# Altium schematic sheet 07_Clocks2.SchDoc: Clocks 2
size A3; Organization: Lime Microsystems; Address1: Surrey Tech Centre; Address2: Guildford GU2 7YG; Address3: Surrey; Address4: United Kingdom; Revision: v1.0; SheetNumber: 7; SheetTotal: 10
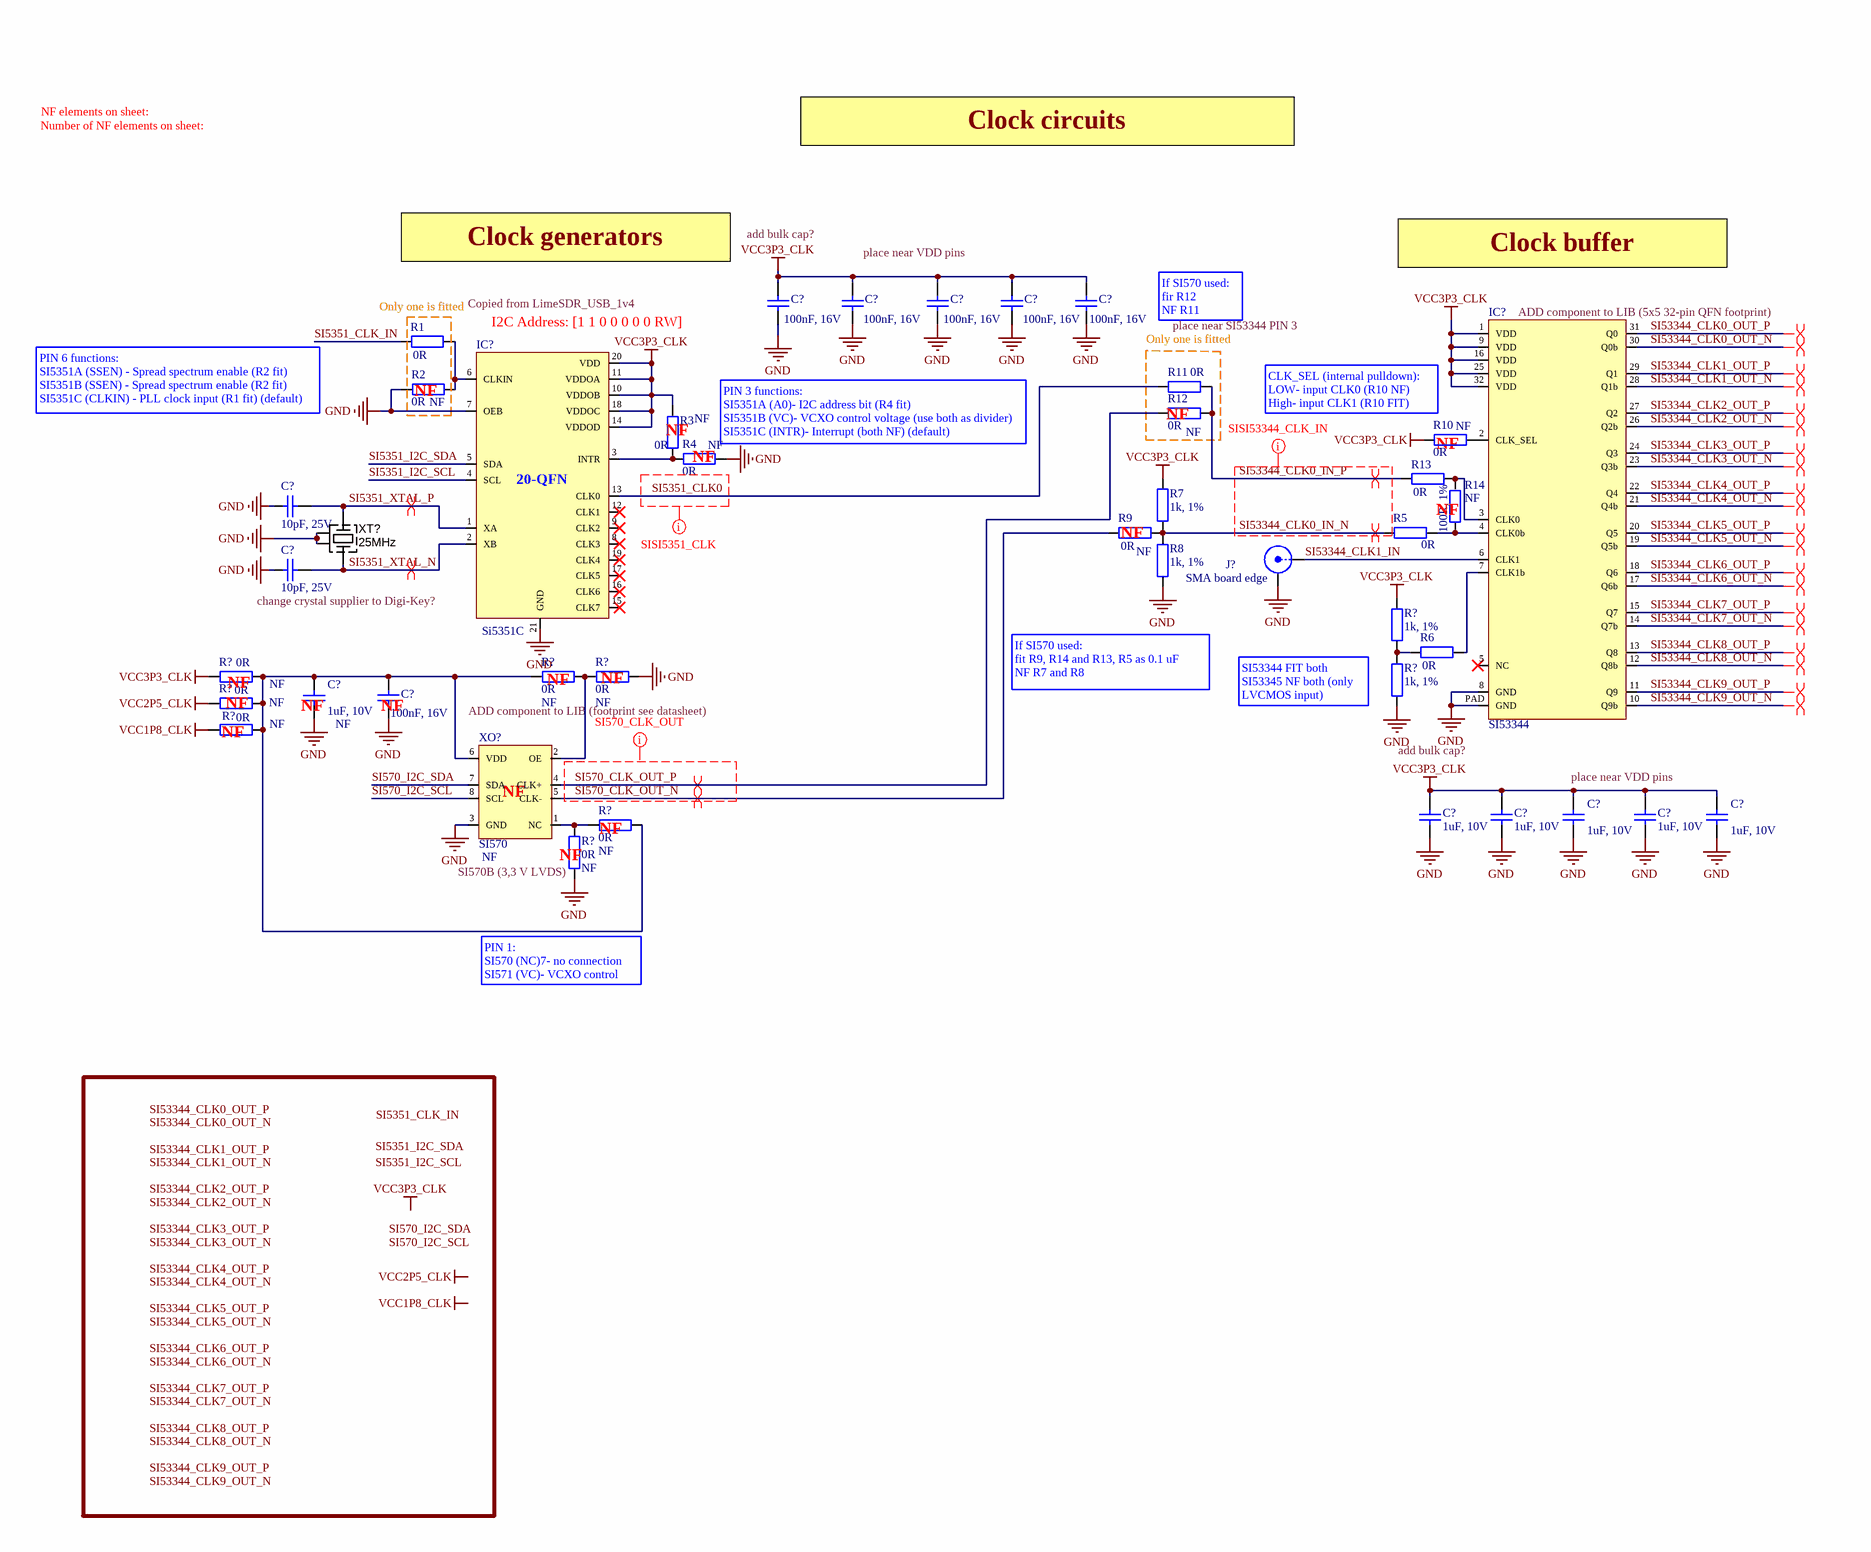
[diagram p0: 07_Clocks2.SchDoc, bottom]

## Parts
(Parts that share a designator on the sheet are numbered #1, #2 ... from top to bottom, then left to right.)
C?#1  100nF, 16V  [CAP0402]
C?#2  100nF, 16V  [CAP0402]
C?#3  100nF, 16V  [CAP0402]
C?#4  100nF, 16V  [CAP0402]
C?#5  100nF, 16V  [CAP0402]
C?#6  10pF, 25V  [CAP0402]
C?#7  10pF, 25V  [CAP0402]
C?#8  1uF, 10V  Assembly Info: NF  [CAP0402]
C?#9  100nF, 16V  [CAP0402]
C?#10  1uF, 10V  [CAP0402]
C?#11  1uF, 10V  [CAP0402]
C?#12  1uF, 10V  [CAP0402]
C?#13  1uF, 10V  [CAP0402]
C?#14  1uF, 10V  [CAP0402]
IC?#1  SI53344
IC?#2  Si5351C  [Si5351C_20QFN]
J?  SMA board edge  [SMA_connector_board_edge_SM]
R1  0R  [RES0402]
R2  0R  Assembly Info: NF  [RES0402]
R3  0R  Assembly Info: NF  [RES0402]
R4  0R  Assembly Info: NF  [RES0402]
R5  0R  [RES0402]
R6  0R  [RES0402]
R7  1k, 1%  [RES0402]
R8  1k, 1%  [RES0402]
R9  0R  Assembly Info: NF  [RES0402]
R10  0R  Assembly Info: NF  [RES0402]
R11  0R  [RES0402]
R12  0R  Assembly Info: NF  [RES0402]
R13  0R  [RES0402]
R14  100R, 1%  Assembly Info: NF  [RES0402]
R?#1  1k, 1%  [RES0402]
R?#2  0R  Assembly Info: NF  [RES0402]
R?#3  0R  Assembly Info: NF  [RES0402]
R?#4  0R  Assembly Info: NF  [RES0402]
R?#5  1k, 1%  [RES0402]
R?#6  0R  Assembly Info: NF  [RES0402]
R?#7  0R  Assembly Info: NF  [RES0402]
R?#8  0R  Assembly Info: NF  [RES0402]
R?#9  0R  Assembly Info: NF  [RES0402]
XO?  SI570  Assembly Info: NF
XT?  25MHz  [CRYSTAL_4-LCC]

## Nets
GND: C?#1.2 C?#2.2 C?#3.2 C?#4.2 C?#5.2 C?#6.1 C?#7.1 C?#8.1 C?#9.2 C?#10.2 C?#11.2 C?#12.1 C?#13.2 C?#14.1 IC?#1.8(GND) IC?#1.PAD(GND) IC?#2.7(OEB) IC?#2.21(GND) J?.2(Y) R2.2 R4.2 R8.1 R?#4.1 R?#5.1 R?#9.1 XO?.3(GND) XT?.2(GND) XT?.4(GND)
VCC1P8_CLK: R?#7.2
VCC2P5_CLK: R?#6.2
VCC3P3_CLK: C?#1.1 C?#2.1 C?#3.1 C?#4.1 C?#5.1 C?#10.1 C?#11.1 C?#12.2 C?#13.1 C?#14.2 IC?#1.1(VDD) IC?#1.9(VDD) IC?#1.16(VDD) IC?#1.25(VDD) IC?#1.32(VDD) IC?#2.10(VDDOB) IC?#2.11(VDDOA) IC?#2.14(VDDOD) IC?#2.18(VDDOC) IC?#2.20(VDD) R3.2 R7.1 R10.1 R?#1.1 R?#2.2
SI570_CLK_OUT_N: R9.1 XO?.5(CLK-)
SI570_CLK_OUT_P: R12.1 XO?.4(CLK+)
SI570_I2C_SCL: XO?.8(SCL)
SI570_I2C_SDA: XO?.7(SDA)
SI5351_CLK0: IC?#2.13(CLK0) R11.1
SI5351_CLK_IN: R1.1
SI5351_I2C_SCL: IC?#2.4(SCL)
SI5351_I2C_SDA: IC?#2.5(SDA)
SI5351_XTAL_N: C?#7.2 IC?#2.2(XB) XT?.3(X)
SI5351_XTAL_P: C?#6.2 IC?#2.1(XA) XT?.1(X)
SI53344_CLK0_IN_N: R5.1 R7.2 R8.2 R9.2
SI53344_CLK0_IN_P: R11.2 R12.2 R13.1
SI53344_CLK0_OUT_N: IC?#1.30(Q0b)
SI53344_CLK0_OUT_P: IC?#1.31(Q0)
SI53344_CLK1_IN: IC?#1.6(CLK1) J?.1(X)
SI53344_CLK1_OUT_N: IC?#1.28(Q1b)
SI53344_CLK1_OUT_P: IC?#1.29(Q1)
SI53344_CLK2_OUT_N: IC?#1.26(Q2b)
SI53344_CLK2_OUT_P: IC?#1.27(Q2)
SI53344_CLK3_OUT_N: IC?#1.23(Q3b)
SI53344_CLK3_OUT_P: IC?#1.24(Q3)
SI53344_CLK4_OUT_N: IC?#1.21(Q4b)
SI53344_CLK4_OUT_P: IC?#1.22(Q4)
SI53344_CLK5_OUT_N: IC?#1.19(Q5b)
SI53344_CLK5_OUT_P: IC?#1.20(Q5)
SI53344_CLK6_OUT_N: IC?#1.17(Q6b)
SI53344_CLK6_OUT_P: IC?#1.18(Q6)
SI53344_CLK7_OUT_N: IC?#1.14(Q7b)
SI53344_CLK7_OUT_P: IC?#1.15(Q7)
SI53344_CLK8_OUT_N: IC?#1.12(Q8b)
SI53344_CLK8_OUT_P: IC?#1.13(Q8)
SI53344_CLK9_OUT_N: IC?#1.10(Q9b)
SI53344_CLK9_OUT_P: IC?#1.11(Q9)
NetC?#8_2: C?#8.2 C?#9.1 R?#2.1 R?#3.2 R?#6.1 R?#7.1 R?#8.1 XO?.6(VDD)
NetIC?#1_2: IC?#1.2(CLK_SEL) R10.2
NetIC?#1_3: IC?#1.3(CLK0) R13.2 R14.2
NetIC?#1_4: IC?#1.4(CLK0b) R5.2 R14.1
NetIC?#1_7: IC?#1.7(CLK1b) R6.2
NetIC?#2_3: IC?#2.3(INTR) R3.1 R4.1
NetIC?#2_6: IC?#2.6(CLKIN) R1.2 R2.1
NetR6_1: R6.1 R?#1.2 R?#5.2
NetR?#3_1: R?#3.1 R?#4.2 XO?.2(OE)
NetR?#8_2: R?#8.2 R?#9.2 XO?.1(NC)

Not connected (* = marked no-connect by the designer): IC?#1 5(NC)*; IC?#2 8(CLK3)* 9(CLK2)* 12(CLK1)* 15(CLK7)* 16(CLK6)* 17(CLK5)* 19(CLK4)*

## Layout directives
differential pair: SI570_CLK_OUT_N, SI570_CLK_OUT_P, SI5351_XTAL_N, SI5351_XTAL_P, SI53344_CLK0_IN_N, SI53344_CLK0_IN_P, SI53344_CLK0_OUT_N, SI53344_CLK0_OUT_P, SI53344_CLK1_OUT_N, SI53344_CLK1_OUT_P, SI53344_CLK2_OUT_N, SI53344_CLK2_OUT_P, SI53344_CLK3_OUT_N, SI53344_CLK3_OUT_P, SI53344_CLK4_OUT_N, SI53344_CLK4_OUT_P, SI53344_CLK5_OUT_N, SI53344_CLK5_OUT_P, SI53344_CLK6_OUT_N, SI53344_CLK6_OUT_P, SI53344_CLK7_OUT_N, SI53344_CLK7_OUT_P, SI53344_CLK8_OUT_N, SI53344_CLK8_OUT_P, SI53344_CLK9_OUT_N, SI53344_CLK9_OUT_P
net class SI_CLK: (no net found under the mark), SI5351_CLK0, SI53344_CLK0_IN_N, SI53344_CLK0_IN_P

## Notes on the sheet
- Number of NF elements on sheet:
- NF elements on sheet:
- Clock circuits
- Clock generators
- (near C?#1) add bulk cap?
- (near C?#3) place near VDD pins
- Clock buffer
- (near R1) Only one is fitted
- Copied from LimeSDR_USB_1v4
- I2C Address: [1 1 0 0 0 0 0 RW]
- Only one is fitted
- If SI570 used:
  fir R12
  NF R11
- place near SI53344 PIN 3
- (near IC?#1) ADD component to LIB (5x5 32-pin QFN footprint)
- PIN 6 functions:
  SI5351A (SSEN) - Spread spectrum enable (R2 fit)
  SI5351B (SSEN) - Spread spectrum enable (R2 fit)
  SI5351C (CLKIN) - PLL clock input (R1 fit) (default)
- (near R2) NF
- (near R3) NF
- (near R12) NF
- (near R10) CLK_SEL (internal pulldown):
  LOW- input CLK0 (R10 NF)
  High- input CLK1 (R10 FIT)
- (near R4) NF
- (near R4) PIN 3 functions:
  SI5351A (A0)- I2C address bit (R4 fit)
  SI5351B (VC)- VCXO control voltage (use both as divider)
  SI5351C (INTR)- Interrupt (both NF) (default)
- (near R10) NF
- (near R9) NF
- (near R14) NF
- (near IC?#2) change crystal supplier to Digi-Key?
- (near R?#2) NF
- (near R?#3) NF
- (near R?#4) NF
- If SI570 used:
  fit R9, R14 and R13, R5 as 0.1 uF
  NF R7 and R8
- (near R?#5) SI53344 FIT both
  SI53345 NF both (only LVCMOS input)
- (near R?#7) NF
- (near R?#6) NF
- (near C?#8) NF
- (near C?#9) NF
- (near R?#4) ADD component to LIB (footprint see datasheet)
- add bulk cap?
- (near XO?) NF
- (near R?#8) NF
- (near C?#13) place near VDD pins
- (near R?#9) SI570B (3,3 V LVDS)
- (near R?#9) NF
- PIN 1:
  SI570 (NC)7- no connection
  SI571 (VC)- VCXO control
- Labels drawn without touching a wire or pin: SI570_I2C_SCL, SI570_I2C_SDA, SI5351_CLK_IN, SI5351_I2C_SCL, SI5351_I2C_SDA, SI53344_CLK0_OUT_N, SI53344_CLK0_OUT_P, SI53344_CLK1_OUT_N, SI53344_CLK1_OUT_P, SI53344_CLK2_OUT_N, SI53344_CLK2_OUT_P, SI53344_CLK3_OUT_N, SI53344_CLK3_OUT_P, SI53344_CLK4_OUT_N, SI53344_CLK4_OUT_P, SI53344_CLK5_OUT_N, SI53344_CLK5_OUT_P, SI53344_CLK6_OUT_N, SI53344_CLK6_OUT_P, SI53344_CLK7_OUT_N, SI53344_CLK7_OUT_P, SI53344_CLK8_OUT_N, SI53344_CLK8_OUT_P, SI53344_CLK9_OUT_N, SI53344_CLK9_OUT_P, VCC1P8_CLK, VCC2P5_CLK, VCC3P3_CLK
- Project name:
- Title:
- Size:
- Date:
- A3
- Revision:
- Time:
- Sheet
- of
- File:
- (in symbol Si5351C) 20-QFN

## Library data of the parts
C?#1-C?#5 = Cap_0603: Manufacturer Part Number 1: GRM155R71C104KA88D; Part Description: 0.10µF ±10% 16V X7R Ceramic Capacitor -55°C ~ 125°C Surface Mount, MLCC 0402 (1005 Metric) 0.039" L x 0.020" W (1.00mm x 0.50mm); Brand: Murata Electronics; Tolerance: 10 %; Type: General Purpose MLCC; Capacitance: 0.1 uF; Temperature Coefficient / Code: +/- 15 %; Supplier 1: Mouser; Supplier Part Number 1: 81-GRM155R71C104KA88; Case Code - in: 0402; Manufacturer: Murata Electronics; Category: Multilayer Ceramic Capacitors MLCC - SMD/SMT; Voltage Rating DC: 16 V; Value: 100nF, 16V; Manufacturer Part Number: GRM155R71C104KA88D
C?#6 C?#7 = Cap_0402: Manufacturer: AVX; Part Description: 10pF ±5% 25V C0G, NP0 Ceramic Capacitor -55°C ~ 125°C Surface Mount, MLCC 0402 (1005 Metric) 0.039" L x 0.020" W (1.00mm x 0.50mm); Capacitance: 10; Ceramic Capacitor Case: 0402 [1005 Metric]; Capacitance Tolerance: ± 5%; Supplier 1: Farnell; Supplier Part Number 1: 2332478RL; value: 10pF, 25V
C?#8 C?#10-C?#14 = Cap_0402: CAP CER 1UF 10V X5R 0402; Manufacturer: Yageo; Part Description: 1µF 10V Ceramic Capacitor X5R 0402 (1005 Metric) 0.039" L x 0.020" W (1.00mm x 0.50mm); Manufacturer Part Number 1: CC0402MRX5R6BB105; Notification: Current market demand for these product types have resulted in fluctuating and extending lead times. Lead times may differ.; Tolerance: ±20%; Value: 1uF, 10V; Supplier 1: Digi-Key; Supplier Part Number 1: 311-1732-1-ND; RoHS: RoHS Compliant; Applications: General Purpose; Category: Capacitors; ComponentLink1Description: http://www.yageo.com/documents/recent/UPY-GPHC_X5R_4V-to-50V_25.pdf; ComponentLink1URL: http://www.yageo.com/documents/recent/UPY-GPHC_X5R_4V-to-50V_25.pdf; Failure Rate: -; Features: -; Height - Seated (Max): -; Lead Spacing: -; Lead Style: -; Mounting Type: Surface Mount, MLCC; Operating Temperature: -55°C ~ 85°C; Package / Case: 0402 (1005 Metric); Packaging: Cut Tape (CT); Part Status: Active; Pricing 1: 1=0.22, 10=0.156, 100=0.0732, 500=0.0513, 1000=0.04248, 2500=0.03953, 5000=0.03617 (USD); Ratings: -; Size / Dimension: 0.039" L x 0.020" W (1.00mm x 0.50mm); Stock 1: 69600; Temperature Coefficient: X5R; Thickness (Max): 0.022" (0.55mm); Voltage - Rated: 10V
C?#9 = Cap_0603: Manufacturer Part Number 1: GRM155R71C104KA88D; Part Description: 0.10µF ±10% 16V X7R Ceramic Capacitor -55°C ~ 125°C Surface Mount, MLCC 0402 (1005 Metric) 0.039" L x 0.020" W (1.00mm x 0.50mm); Brand: Murata Electronics; Tolerance: 10 %; Type: General Purpose MLCC; Capacitance: 0.1 uF; Temperature Coefficient / Code: +/- 15 %; Assembly Info: NF; Supplier 1: Mouser; Supplier Part Number 1: 81-GRM155R71C104KA88; Case Code - in: 0402; Manufacturer: Murata Electronics; Category: Multilayer Ceramic Capacitors MLCC - SMD/SMT; Voltage Rating DC: 16 V; Value: 100nF, 16V; Manufacturer Part Number: GRM155R71C104KA88D
IC?#1 = SI53344: Manufacturer: Skyworks Solutions; Manufacturer Part Number: SI53344-B-GM; Part Description: Clock Fanout Buffer (Distribution), Multiplexer IC 2:10 1.25 GHz 32-VFQFN Exposed Pad; Supplier 1: Digi-Key; Supplier Part Number 1: 336-3842-ND; Stock 1: 4927; Pricing 1: 1=4,47000, 10=4,01100, 25=3,79200, 80=3,28650, 230=3,11800, 490=2,79776, 980=2,38500 (USD); RoHS: No
IC?#2 = Si5351C: Manufacturer Part Number 1: SI5351C-B-GM; Part Description: IC CLK GENERATOR 200MHZ 20QFN; Manufacturer: Silicon Labs; Voltage - Supply: 1.71 V ~ 3.6 V; Input: Clock, Crystal; Ratio - Input:Output: 2:8; Frequency - Max: 160MHz; Supplier 1: Digi-Key; Supplier Device Package: 20-QFN (4x4); Type: Clock Generator; Package / Case: 20-VFQFN Exposed Pad; Category: Integrated Circuits (ICs); Supplier Part Number 1: 336-2402-ND
J? = RF_IF_connector: CONN SMA JACK STR 50OHM EDGE MNT; Manufacturer: RF Solutions; Manufacturer Part Number 1: CON-SMA-EDGE-S; Part Description: SMA Connector Jack, Female Socket Board Edge, End Launch Solder; Connector Type: Jack, Female Socket; Contact Termination: Solder; Supplier 1: Digi-Key; Supplier Part Number 1: CON-SMA-EDGE-S-ND; RoHS: RoHS Compliant; Category: Connectors, Interconnects; Stock 1: 1751; Pricing 1: 1=2.1 (USD); Packaging: -; Part Status: Active; Connector Style: SMA; Shield Termination: Solder; Impedance: -; Mounting Type: Board Edge, End Launch; Mounting Feature: -; Cable Group: -; Fastening Type: Threaded; Frequency - Max: -; Features: -; Housing Color: -; Ingress Protection: -; Includes: -; Body Material: -; Body Finish: -; Center Contact Plating: -; Dielectric Material: -; Operating Temperature: -; Center Contact Material: -; Voltage Rating: -; Mating Cycles: -; Insertion Loss: -; ComponentLink1URL: http://media.digikey.com/pdf/Data%20Sheets/RF%20Solutions%20PDFs/CON-SMA-EDGE.pdf; ComponentLink1Description: http://media.digikey.com/pdf/Data%20Sheets/RF%20Solutions%20PDFs/CON-SMA-EDGE.pdf
R1-R6 R9-R13 R?#2-R?#4 R?#6-R?#9 = Res_0402: Manufacturer Part Number 1: RC0402JR-070RL; Manufacturer: Yageo; Part Description: RES SMD 0.0OHM JUMPER 1/16W 0402; Resistance (Ohms): 0.0; Tolerance: Jumper; Power (Watts): 0.063W, 1/16W; Value: 0R; Supplier 1: Digi-Key; Supplier Part Number 1: 311-0.0JRTR-ND; Category: Resistors; Temperature Coefficient: -; Features: Moisture Resistant; Supplier Device Package: 0402; Height: 0.016" (0.40mm); Package / Case: 0402 (1005 Metric); Operating Temperature: -55°C ~ 155°C; Size / Dimension: 0.039" L x 0.020" W (1.00mm x 0.50mm); Composition: Thick Film; Packaging: Tape & Reel (TR); Number of Terminations: 2; RoHS: RoHS Compliant
R7 R8 R?#1 R?#5 = Res_0402: Manufacturer: Stackpole Electronics Inc; Manufacturer Part Number 1: RMCF0402FT1K00; Part Description: RES SMD 1K OHM 1% 1/16W 0402; Temperature Coefficient: ±100ppm/°C; Power (Watts): 0.063W, 1/16W; Value: 1k, 1%; Supplier 1: Digi-Key; Supplier Part Number 1: RMCF0402FT1K00TR-ND; Resistance (Ohms): 1k; Packaging: Tape & Reel (TR); Category: Resistors; RoHS: RoHS Compliant; Tolerance: ±1%; Height: 0.016" (0.40mm); Number of Terminations: 2; Package / Case: 0402 (1005 Metric); Operating Temperature: -55°C ~ 155°C; Features: -; Composition: Thick Film; Supplier Device Package: 0402; Size / Dimension: 0.039" L x 0.020" W (1.00mm x 0.50mm)
R14 = Res_0402: Manufacturer Part Number 1: RMCF0402FT100R; Part Description: RES SMD 100 OHM 1% 1/16W 0402; Manufacturer: Stackpole Electronics Inc.; Temperature Coefficient: ±100ppm/°C; Supplier 1: Digi-Key; Supplier Part Number 1: RMCF0402FT100RDKR-ND; Package / Case: 0402 (1005 Metric); Composition: Thick Film; Category: Resistors; Tolerance: ±1%; Value: 100R, 1%
XO? = SI570: Part Description: XTAL OSC XO 300.0000MHZ LVDS SMD; Manufacturer: Silicon Labs; Manufacturer Part Number: 570BAB001614DGR; Description: Oscillator XO 300MHz ±61.5ppm LVDS 55% 3.3V 8-Pin SMD T/R; ComponentLink1URL: https://datasheet.ciiva.com/9287/si570-9287030.pdf?src-supplier=Avnet; ComponentLink1Description: https://datasheet.ciiva.com/9287/si570-9287030.pdf?src-supplier=Avnet; Supplier 1: Digi-Key; Supplier Part Number 1: 336-5615-1-ND; Stock 1: 82; Pricing 1: 250=23,87000 (EUR); RoHS: Yes
XT? = CRYSTAL_19M2: Oscillator Crystal 25 MHz; Manufacturer Part Number 1: ABM8-25.000MHZ-B2-T; Manufacturer: ABRACON; Part Description: 25MHz ±20ppm Crystal 18pF 50 Ohm -20°C ~ 70°C Surface Mount 4-SMD, No Lead (DFN, LCC); Supplier 1: Newark; Supplier Part Number 1: 13J1767